# Altium schematic sheet PM254V-11-04-H85.schdoc
size 127 x 101 mm
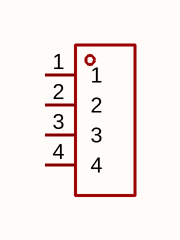
[diagram p0: PM254V-11-04-H85.schdoc]

## Parts
H?  pm254v-11-04-h85  [HDR-TH_4P-P2.54-V-F]  (value not drawn)

## Nets

Not connected (* = marked no-connect by the designer): H? 1 2 3 4

## Library data of the parts
H? = pm254v-11-04-h85: 插孔结构:1x4P;间距:2.54mm;行距:-;圆孔/方孔:方孔;安装方式:直插;排数:单排;总孔位数:4P;额定电流:3A;插孔方向:顶部;塑高:8.5mm;触头材质:黄铜;触头镀层:-;工作温度:-40℃~+105℃;; Manufacturer: XFCN(兴飞); AddInBom: yes; ModelId: d187812051054f85879fcaa51a310d8e; ModelTransform: 419.6842,98.464,0,0,0,0,0,0,-118.11; Holes Structure: 1x4P; Pitch: 2.54mm; Circular Hole / Square Hole: 方孔; Number of Positions: 4P; Current Rating: 3A; Holes Direction: 顶部; Symbol: PM254V-11-04-H85; LCSC Part Name: 1x4P 间距:2.54mm 直插; SupplierPart: C541851; ManufacturerPart: PM254V-11-04-H85; Supplier Footprint: 插件,P=2.54mm; JLCPCB Part Class: Extended Part; Datasheet: https://item.szlcsc.com/datasheet/PM254V-11-04-H85/562472.html; Supplier: LCSC; ConvertToPcb: yes; FootprintName: HDR-TH_4P-P2.54-V-F; ModelName: HDR-TH_4P-P2.54-V-F; Row Spacing: -; Mounting Type: 直插; Number of Rows: 单排; Insulation Height: 8.5mm; Contact Material: 黄铜; Contact Plating: -; Operating Temperature: -40℃~+105℃